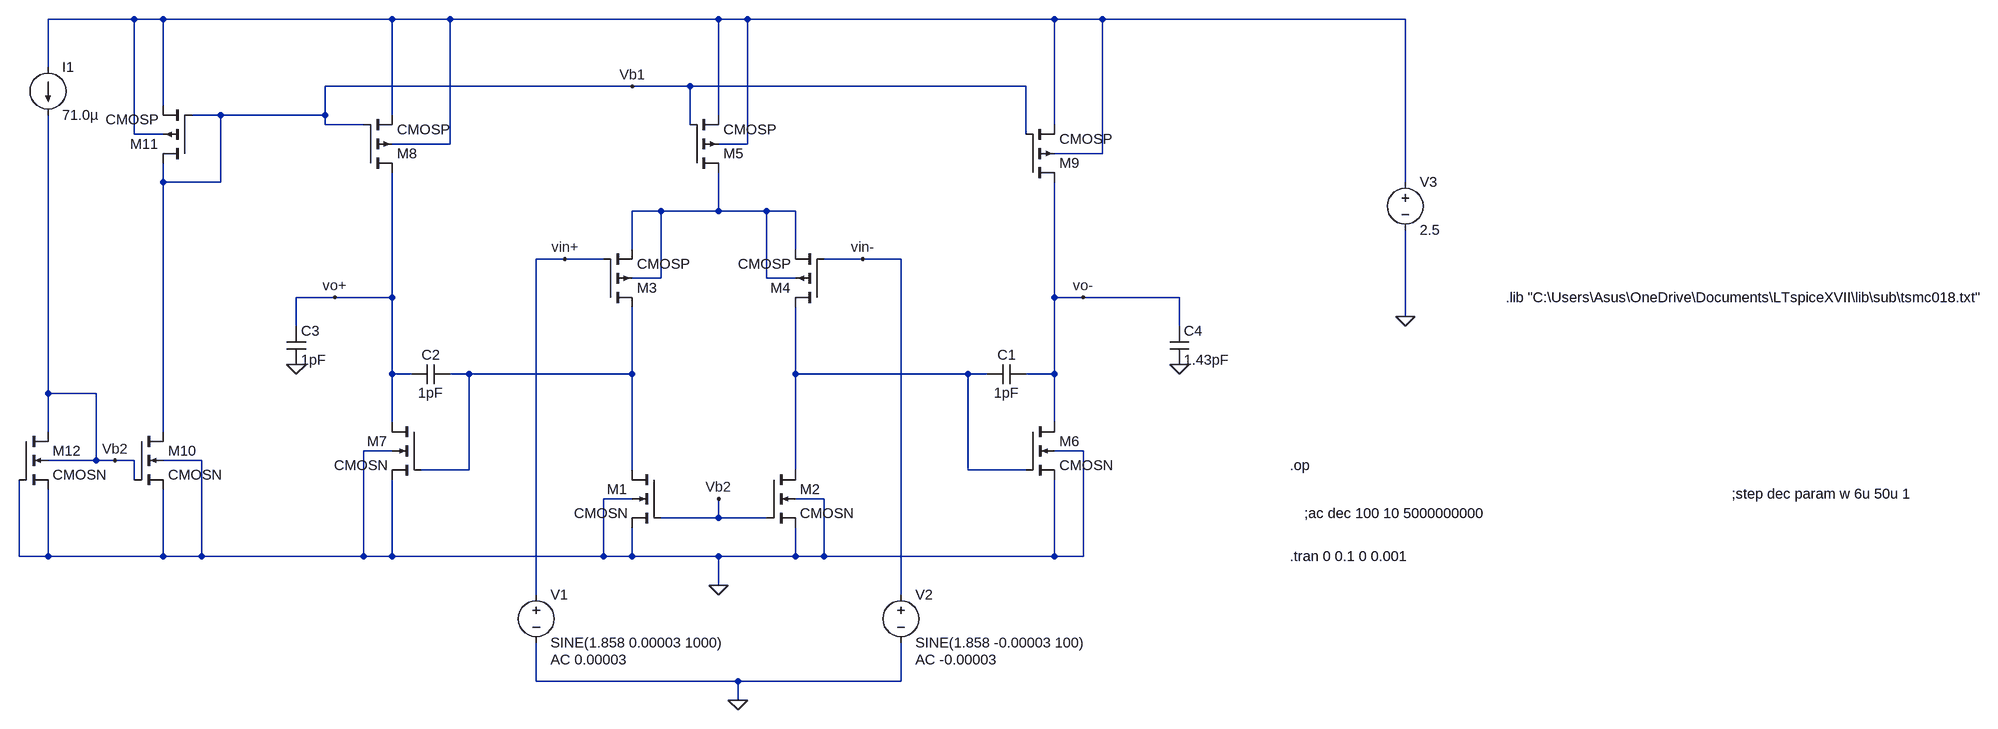
[diagram p0: schematic Assignment_Schematic.asc]
Assignment_Schematic.asc, the LTspice schematic file:
Version 4
SHEET 1 2592 680
WIRE -672 -528 -816 -528
WIRE -624 -528 -672 -528
WIRE -192 -528 -624 -528
WIRE -96 -528 -192 -528
WIRE 352 -528 -96 -528
WIRE 400 -528 352 -528
WIRE 912 -528 400 -528
WIRE 992 -528 912 -528
WIRE 1520 -528 992 -528
WIRE -816 -448 -816 -528
WIRE 208 -416 -304 -416
WIRE 304 -416 208 -416
WIRE 864 -416 304 -416
WIRE -624 -384 -624 -528
WIRE -528 -368 -576 -368
WIRE -304 -368 -304 -416
WIRE -304 -368 -528 -368
WIRE -192 -368 -192 -528
WIRE 352 -368 352 -528
WIRE -304 -352 -304 -368
WIRE -240 -352 -304 -352
WIRE 304 -352 304 -416
WIRE 912 -352 912 -528
WIRE -672 -336 -672 -528
WIRE -624 -336 -672 -336
WIRE 864 -336 864 -416
WIRE -96 -320 -96 -528
WIRE -96 -320 -192 -320
WIRE 400 -320 400 -528
WIRE 400 -320 352 -320
WIRE 992 -304 992 -528
WIRE 992 -304 912 -304
WIRE -624 -256 -624 -288
WIRE -528 -256 -528 -368
WIRE -528 -256 -624 -256
WIRE 1520 -256 1520 -528
WIRE 256 -208 208 -208
WIRE 352 -208 352 -272
WIRE 352 -208 256 -208
WIRE 432 -208 352 -208
WIRE 480 -208 432 -208
WIRE 208 -144 208 -208
WIRE 480 -144 480 -208
WIRE 96 -128 48 -128
WIRE 160 -128 96 -128
WIRE 592 -128 528 -128
WIRE 656 -128 592 -128
WIRE 256 -96 256 -208
WIRE 256 -96 208 -96
WIRE 432 -96 432 -208
WIRE 480 -96 432 -96
WIRE -288 -64 -352 -64
WIRE -192 -64 -192 -272
WIRE -192 -64 -288 -64
WIRE 912 -64 912 -256
WIRE 960 -64 912 -64
WIRE 1120 -64 960 -64
WIRE 1520 -32 1520 -176
WIRE -352 -16 -352 -64
WIRE 1120 -16 1120 -64
WIRE -192 64 -192 -64
WIRE -160 64 -192 64
WIRE -64 64 -96 64
WIRE 208 64 208 -48
WIRE 208 64 -64 64
WIRE 480 64 480 -48
WIRE 768 64 480 64
WIRE 800 64 768 64
WIRE 912 64 912 -64
WIRE 912 64 864 64
WIRE -816 96 -816 -368
WIRE -736 96 -816 96
WIRE -192 144 -192 64
WIRE 912 144 912 64
WIRE -816 160 -816 96
WIRE -624 160 -624 -256
WIRE -192 192 -240 192
WIRE 960 192 912 192
WIRE -736 208 -736 96
WIRE -736 208 -816 208
WIRE -704 208 -736 208
WIRE -672 208 -704 208
WIRE -560 208 -624 208
WIRE -64 224 -64 64
WIRE -64 224 -144 224
WIRE 208 224 208 64
WIRE 480 224 480 64
WIRE 768 224 768 64
WIRE 864 224 768 224
WIRE -672 240 -672 208
WIRE 208 272 160 272
WIRE 528 272 480 272
WIRE 352 304 352 272
WIRE 352 304 256 304
WIRE 432 304 352 304
WIRE -864 368 -864 240
WIRE -816 368 -816 256
WIRE -816 368 -864 368
WIRE -624 368 -624 256
WIRE -624 368 -816 368
WIRE -560 368 -560 208
WIRE -560 368 -624 368
WIRE -240 368 -240 192
WIRE -240 368 -560 368
WIRE -192 368 -192 240
WIRE -192 368 -240 368
WIRE 160 368 160 272
WIRE 160 368 -192 368
WIRE 208 368 208 320
WIRE 208 368 160 368
WIRE 352 368 208 368
WIRE 480 368 480 320
WIRE 480 368 352 368
WIRE 528 368 528 272
WIRE 528 368 480 368
WIRE 912 368 912 240
WIRE 912 368 528 368
WIRE 960 368 960 192
WIRE 960 368 912 368
WIRE 352 416 352 368
WIRE 48 432 48 -128
WIRE 656 432 656 -128
WIRE 48 576 48 512
WIRE 384 576 48 576
WIRE 656 576 656 512
WIRE 656 576 384 576
WIRE 384 608 384 576
FLAG 384 608 0
FLAG 352 416 0
FLAG 352 272 Vb2
FLAG 208 -416 Vb1
FLAG 1520 -32 0
FLAG -352 48 0
FLAG 1120 48 0
FLAG -704 208 Vb2
FLAG 960 -64 vo-
FLAG -288 -64 vo+
FLAG 592 -128 vin-
FLAG 96 -128 vin+
DATAFLAG 80 -144 ""
SYMBOL cmosp 160 -48 M180
SYMATTR InstName M3
SYMATTR Value2 l=0.35u w=34.65u
SYMBOL cmosp 528 -48 R180
SYMATTR InstName M4
SYMATTR Value2 l=0.35u w=34.65u
SYMBOL cmosp 304 -272 M180
SYMATTR InstName M5
SYMATTR Value2 l=0.35u w=65.8u
SYMBOL voltage 48 416 R0
WINDOW 123 24 124 Left 2
WINDOW 39 0 0 Left 0
SYMATTR Value2 AC 0.00003
SYMATTR InstName V1
SYMATTR Value SINE(1.858 0.00003 1000)
SYMBOL voltage 656 416 R0
WINDOW 123 24 124 Left 2
WINDOW 39 0 0 Left 0
SYMATTR Value2 AC -0.00003
SYMATTR InstName V2
SYMATTR Value SINE(1.858 -0.00003 100)
SYMBOL cmosn 256 224 M0
SYMATTR InstName M1
SYMATTR Value2 l=0.35u w=5.6u
SYMBOL cmosn 432 224 R0
SYMATTR InstName M2
SYMATTR Value2 l=0.35u w=5.6u
SYMBOL cmosn 864 144 R0
SYMATTR InstName M6
SYMATTR Value2 l=0.35u w=2.8u
SYMBOL cmosn -144 144 M0
SYMATTR InstName M7
SYMATTR Value2 l=0.35u w=2.8u
SYMBOL cmosp -240 -272 M180
SYMATTR InstName M8
SYMATTR Value2 l=0.35u w=56u
SYMBOL cmosp 864 -256 M180
SYMATTR InstName M9
SYMATTR Value2 l=0.35u w=56u
SYMBOL voltage 1520 -272 R0
WINDOW 123 0 0 Left 0
WINDOW 39 0 0 Left 0
SYMATTR InstName V3
SYMATTR Value 2.5
SYMBOL cap 864 48 R90
WINDOW 0 0 32 VBottom 2
WINDOW 3 32 32 VTop 2
SYMATTR InstName C1
SYMATTR Value 1pF
SYMBOL cap -96 48 R90
WINDOW 0 0 32 VBottom 2
WINDOW 3 32 32 VTop 2
SYMATTR InstName C2
SYMATTR Value 1pF
SYMBOL cap -368 -16 R0
SYMATTR InstName C3
SYMATTR Value 1pF
SYMBOL cap 1104 -16 R0
SYMATTR InstName C4
SYMATTR Value 1.43pF
SYMBOL cmosn -672 160 R0
SYMATTR InstName M10
SYMATTR Value2 l=0.35u w=2.8u
SYMBOL cmosp -576 -288 R180
SYMATTR InstName M11
SYMATTR Value2 l=0.35u w=16.45u
SYMBOL current -816 -448 R0
WINDOW 123 0 0 Left 0
WINDOW 39 0 0 Left 0
SYMATTR InstName I1
SYMATTR Value 71.0µ
SYMBOL cmosn -864 160 R0
SYMATTR InstName M12
SYMATTR Value2 l=0.35u w=2.8u
TEXT 1328 216 Left 2 !.op
TEXT 1352 296 Left 2 !;ac dec 100 10 5000000000
TEXT 1688 -64 Left 2 !.lib "C:\\Users\\Asus\\OneDrive\\Documents\\LTspiceXVII\\lib\\sub\\tsmc018.txt"
TEXT 2064 264 Left 2 !;step dec param w 6u 50u 1
TEXT 1328 368 Left 2 !.tran 0 0.1 0 0.001

The netlist it stands for:
* Assignment_Schematic.asc
M3 N003 vin+ N002 N002 CMOSP l=0.35u w=34.65u
M4 N004 vin- N002 N002 CMOSP l=0.35u w=34.65u
M5 N002 Vb1 N001 N001 CMOSP l=0.35u w=65.8u
V1 vin+ 0 SINE(1.858 0.00003 1000) AC 0.00003
V2 vin- 0 SINE(1.858 -0.00003 100) AC -0.00003
M1 N003 Vb2 0 0 CMOSN l=0.35u w=5.6u
M2 N004 Vb2 0 0 CMOSN l=0.35u w=5.6u
M6 vo- N004 0 0 CMOSN l=0.35u w=2.8u
M7 vo+ N003 0 0 CMOSN l=0.35u w=2.8u
M8 vo+ Vb1 N001 N001 CMOSP l=0.35u w=56u
M9 vo- Vb1 N001 N001 CMOSP l=0.35u w=56u
V3 N001 0 2.5
C1 vo- N004 1pF
C2 N003 vo+ 1pF
C3 vo+ 0 1pF
C4 vo- 0 1.43pF
M10 Vb1 Vb2 0 0 CMOSN l=0.35u w=2.8u
M11 Vb1 Vb1 N001 N001 CMOSP l=0.35u w=16.45u
I1 N001 Vb2 71.0µ
M12 Vb2 0 0 Vb2 CMOSN l=0.35u w=2.8u
.model NMOS NMOS
.model PMOS PMOS
.lib standard.mos
.op
;ac dec 100 10 5000000000
.lib "C:\Users\Asus\OneDrive\Documents\LTspiceXVII\lib\sub\tsmc018.txt"
;step dec param w 6u 50u 1
.tran 0 0.1 0 0.001
.backanno
.end